# EAGLE design Uzebox Mini COLOR (EAGLE 5.06)
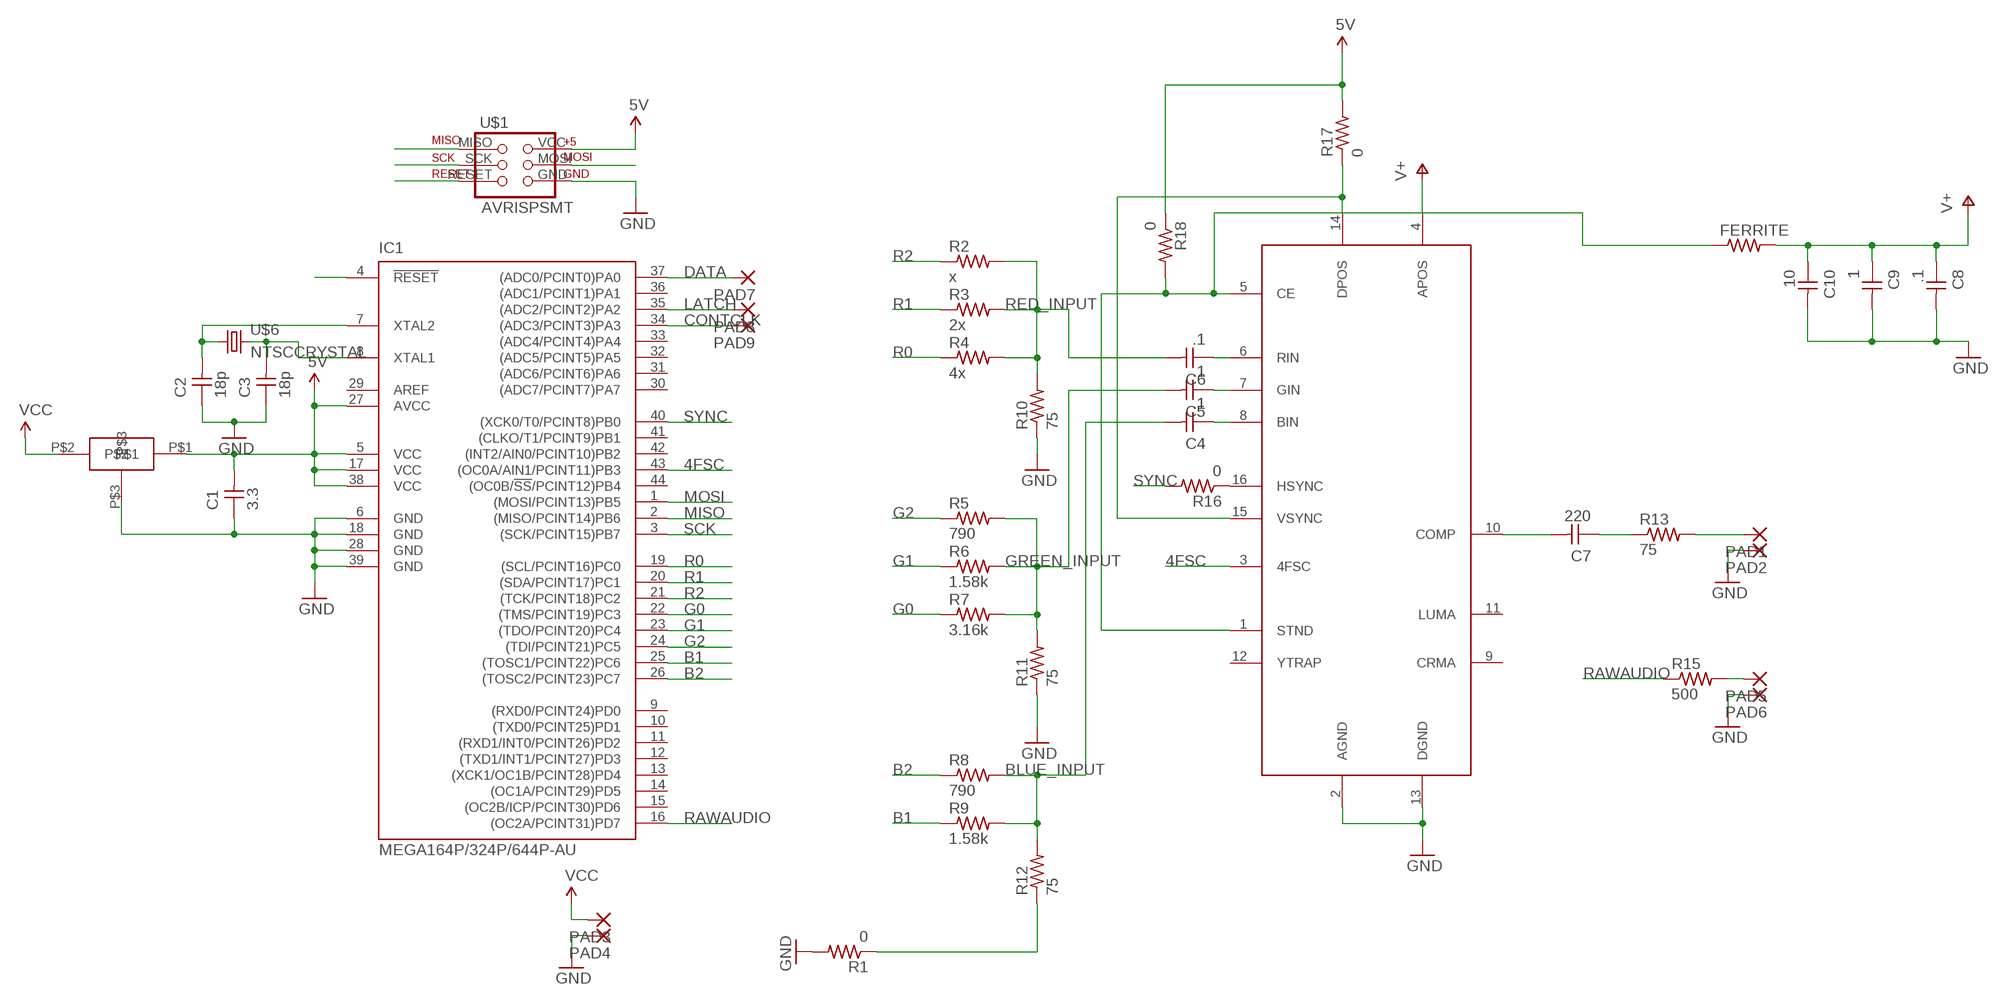
[diagram p0: schematic, sheet 1]

## Parts
C1  3.3  UNPOLARIZED_CAPACITOR1206  [1206]
C2  18p  UNPOLARIZED_CAPACITOR1206  [1206]
C3  18p  UNPOLARIZED_CAPACITOR1206  [1206]
C4  .1  UNPOLARIZED_CAPACITOR1206  [1206]
C5  .1  UNPOLARIZED_CAPACITOR1206  [1206]
C6  .1  UNPOLARIZED_CAPACITOR1206  [1206]
C7  220  UNPOLARIZED_CAPACITOR1206  [1206]
C8  .1  UNPOLARIZED_CAPACITOR1206  [1206]
C9  1  UNPOLARIZED_CAPACITOR1206  [1206]
C10  10  UNPOLARIZED_CAPACITOR1206  [1206]
FERRITE  RESISTOR1206  [1206]
IC1  MEGA164P/324P/644P-AU  MEGA164P/324P/644P-AUSMALLPADS  [TQFP44SMALLPADS]
PAD1  SMD2  [SMD1,27-2,54]
PAD2  SMD2  [SMD1,27-2,54]
PAD3  SMD2  [SMD1,27-2,54]
PAD4  SMD2  [SMD1,27-2,54]
PAD5  SMD2  [SMD1,27-2,54]
PAD6  SMD2  [SMD1,27-2,54]
PAD7  SMD2  [SMD1,27-2,54]
PAD8  SMD2  [SMD1,27-2,54]
PAD9  SMD2  [SMD1,27-2,54]
R1  0  RESISTOR1206  [1206]
R2  x  RESISTOR1206  [1206]
R3  2x  RESISTOR1206  [1206]
R4  4x  RESISTOR1206  [1206]
R5  790  RESISTOR1206  [1206]
R6  1.58k  RESISTOR1206  [1206]
R7  3.16k  RESISTOR1206  [1206]
R8  790  RESISTOR1206  [1206]
R9  1.58k  RESISTOR1206  [1206]
R10  75  RESISTOR1206  [1206]
R11  75  RESISTOR1206  [1206]
R12  75  RESISTOR1206  [1206]
R13  75  RESISTOR1206  [1206]
R15  500  RESISTOR1206  [1206]
R16  0  RESISTOR1206  [1206]
R17  0  RESISTOR1206  [1206]
R18  0  RESISTOR1206  [1206]
U$1  AVRISPSMT  [SMTAVRISP]
U$5  TINYREG  [SOT-23]
U$6  NTSCCRYSTAL  [NTSCCRYSTAL]
U$11  AD725  [SO16L]

## Nets
4FSC: IC1.43((OC0A/AIN1/PCINT11)PB3) U$11.3(4FSC)
5V: C1.2 IC1.5(VCC) IC1.17(VCC) IC1.27(AVCC) IC1.38(VCC) R17.2 R18.1 U$1.VCC U$5.P$1
AUDIO: PAD5.1(P) R15.2
B1: IC1.25((TOSC1/PCINT22)PC6) R9.1
B2: IC1.26((TOSC2/PCINT23)PC7) R8.1
BLUE_INPUT: C4.2 R8.2 R9.2 R12.2
CONTCLK: IC1.34((ADC3/PCINT3)PA3) PAD9.1(P)
DATA: IC1.37((ADC0/PCINT0)PA0) PAD7.1(P)
G0: IC1.22((TMS/PCINT19)PC3) R7.1
G1: IC1.23((TDO/PCINT20)PC4) R6.1
G2: IC1.24((TDI/PCINT21)PC5) R5.1
GND: C1.1 C2.1 C3.1 C8.2 C9.2 C10.2 IC1.6(GND) IC1.18(GND) IC1.28(GND) IC1.39(GND) PAD2.1(P) PAD4.1(P) PAD6.1(P) R1.2 R10.1 R11.1 U$1.GND U$5.P$3 U$11.2(AGND) U$11.13(DGND)
GREEN_INPUT: C5.2 R5.2 R6.2 R7.2 R11.2
LATCH: IC1.35((ADC2/PCINT2)PA2) PAD8.1(P)
MISO: IC1.2((MISO/PCINT14)PB6) U$1.MISO
MOSI: IC1.1((MOSI/PCINT13)PB5) U$1.MOSI
N$1: R17.1 U$11.14(DPOS) U$11.15(VSYNC)
N$2: C2.2 IC1.7(XTAL2) U$6.1
N$3: C3.2 IC1.8(XTAL1) U$6.3
N$5: C6.1 U$11.6(RIN)
N$6: C5.1 U$11.7(GIN)
N$7: C4.1 U$11.8(BIN)
N$8: C7.2 U$11.10(COMP)
N$9: C7.1 R13.1
N$10: PAD1.1(P) R13.2
N$11: R1.1 R12.1
N$12: R16.1 U$11.16(HSYNC)
N$16: FERRITE.1 R18.2 U$11.1(STND) U$11.5(CE)
R0: IC1.19((SCL/PCINT16)PC0) R4.1
R1: IC1.20((SDA/PCINT17)PC1) R3.1
R2: IC1.21((TCK/PCINT18)PC2) R2.1
RAWAUDIO: IC1.16((OC2A/PCINT31)PD7) R15.1
RED_INPUT: C6.2 R2.2 R3.2 R4.2 R10.2
RESET: IC1.4(!RESET) U$1.RESET
SCK: IC1.3((SCK/PCINT15)PB7) U$1.SCK
SYNC: IC1.40((XCK0/T0/PCINT8)PB0) R16.2
V+: C8.1 C9.1 C10.1 FERRITE.2 U$11.4(APOS)
VCC: PAD3.1(P) U$5.P$2
Unconnected: IC1.9((RXD0/PCINT24)PD0) IC1.10((TXD0/PCINT25)PD1) IC1.11((RXD1/INT0/PCINT26)PD2) IC1.12((TXD1/INT1/PCINT27)PD3) IC1.13((XCK1/OC1B/PCINT28)PD4) IC1.14((OC1A/PCINT29)PD5) IC1.15((OC2B/ICP/PCINT30)PD6) IC1.30((ADC7/PCINT7)PA7) IC1.31((ADC6/PCINT6)PA6) IC1.32((ADC5/PCINT5)PA5) IC1.33((ADC4/PCINT4)PA4) IC1.36((ADC1/PCINT1)PA1) IC1.41((CLKO/T1/PCINT9)PB1) IC1.42((INT2/AIN0/PCINT10)PB2) IC1.44((OC0B/!SS!/PCINT12)PB4) U$11.9(CRMA) U$11.11(LUMA) U$11.12(YTRAP)

## Power pins joined to a net without a drawn wire
AREF: IC1.29(AREF)

## Library data of the parts
C1-C10 = ng:UNPOLARIZED_CAPACITOR: unpolarized_capacitor
FERRITE R1-R13 R15-R18 = ng:RESISTOR
IC1 = avr-6:MEGA164P/324P/644P-AU
PAD1-PAD9 = wirepad:SMD2: SMD PAD
U$1 = david-lib:AVRISPSMT
U$5 = david-lib:TINYREG
U$6 = david-lib:NTSCCRYSTAL
U$11 = SparkFun:AD725

## Board
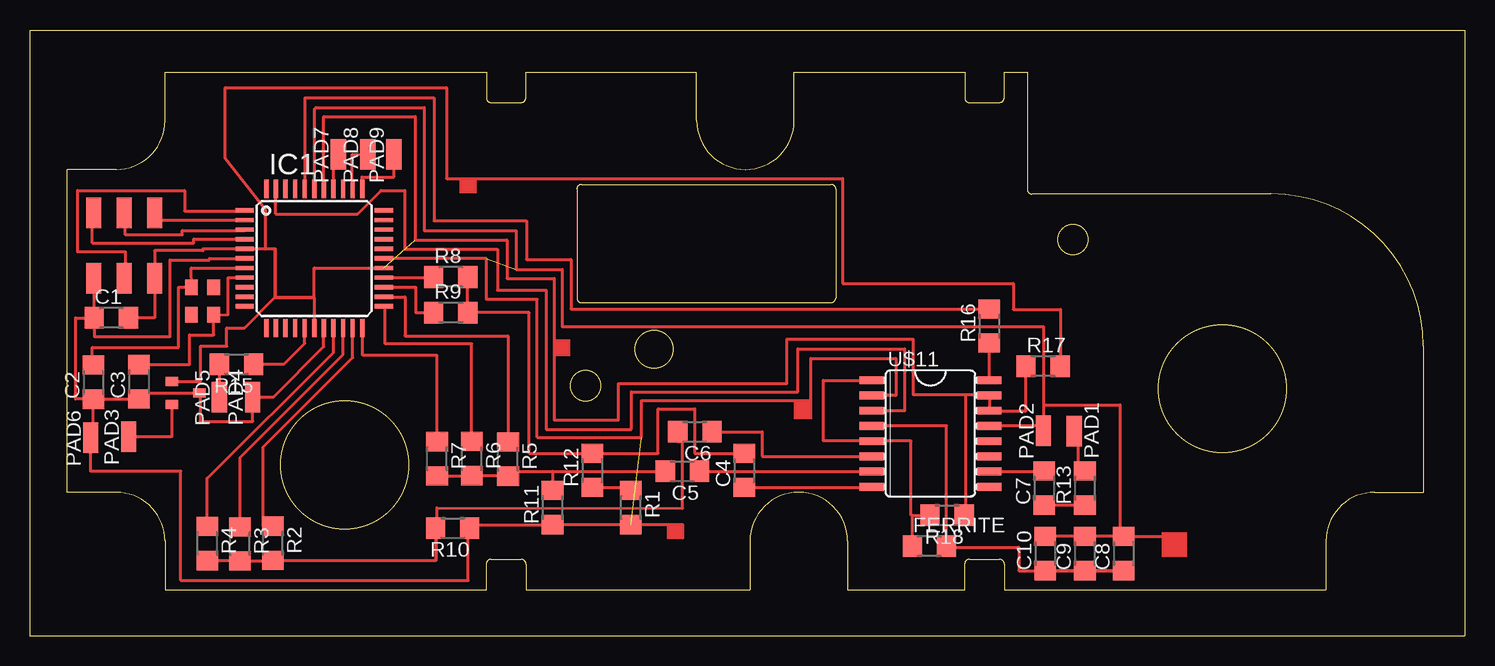
[diagram p1: board, top side]
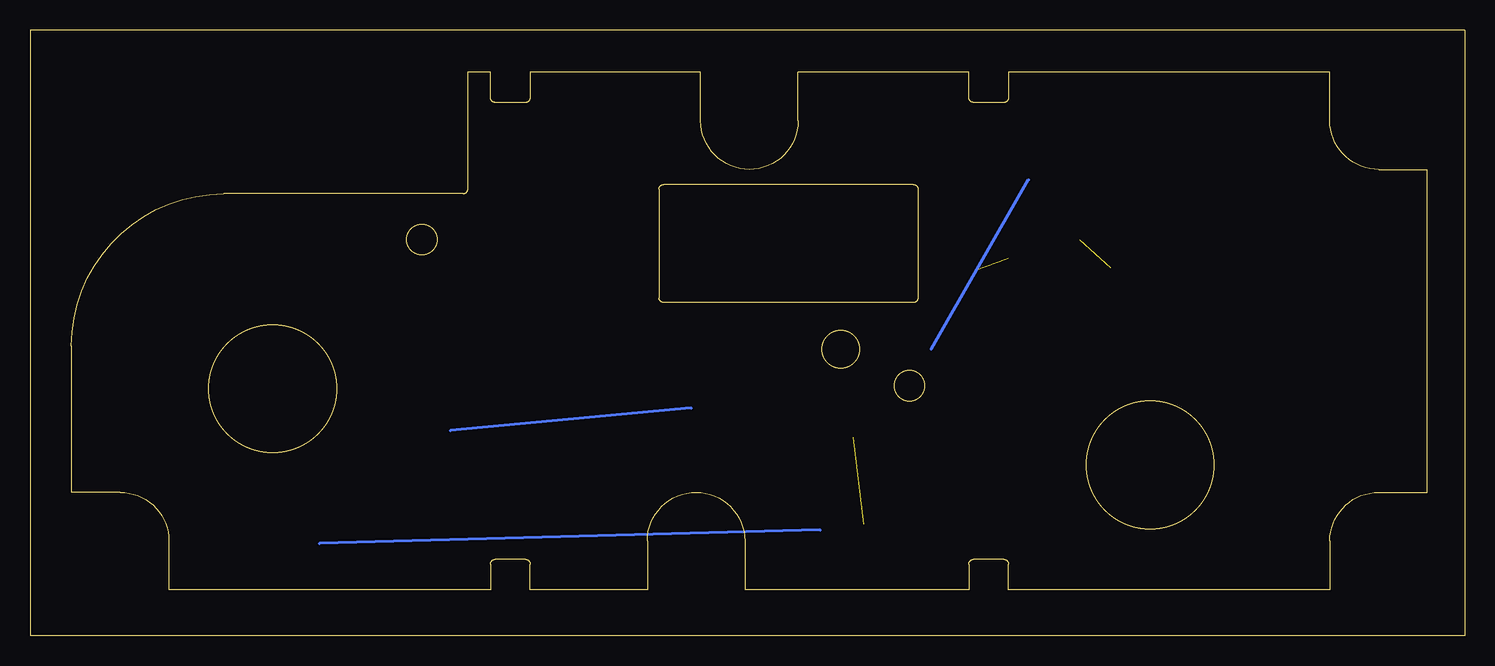
[diagram p2: board, bottom side, seen from below]

Size 119.61 x 50.52 mm. Coordinates in mm from the lower left corner, seen from the top.
Outline: 45.58,37.24 arc-92 45.97,37.64 66.78,37.64 arc-90 67.18,37.24 67.18,28.17
Outline: 45.97,27.78 arc-88 45.59,28.14 45.59,37.21
Outline: 67.17,28.17 arc-88 66.78,27.79 45.97,27.79
Outline: 38.43,44.46 arc-88 38.05,44.86 38.05,47.02 11.25,47.02 11.25,42.95 arc-90 7.19,38.89 3.12,38.89 3.12,11.96 7.19,11.96 arc-90 11.25,7.9 11.25,3.84 38.05,3.84 38.05,5.97
Outline: 41.34,44.86 arc-88 40.94,44.48 38.43,44.48
Outline: 78.31,44.46 arc-88 77.93,44.86 77.93,47.02 63.7,47.02 63.7,42.95 arc-180 55.58,42.95 55.58,47.02 41.35,47.02 41.35,44.86
Outline: 81.22,44.86 arc-88 80.82,44.48 78.31,44.48
Outline: 38.04,5.97 arc-92 38.43,6.38 40.94,6.38 arc-90 41.35,5.97 41.35,3.84 60.02,3.84 60.02,7.9 arc-180 68.15,7.9 68.15,3.84 77.93,3.84 77.93,5.97
Outline: 77.91,5.97 arc-92 78.31,6.38 80.82,6.38 arc-90 81.23,5.97 81.23,3.84 108.03,3.84 108.03,7.9 arc-90 112.09,11.96 116.15,11.96 116.15,24.16 arc90 103.45,36.86 83.52,36.86
Outline: 83.51,36.84 arc-88 83.13,37.24 83.13,47.02 81.23,47.02 81.23,44.86
Outline: 0,50.52 119.61,50.52 119.61,0 0,0 0,50.52
Outline: circle at 99.39,20.6 radius 5.33
Outline: circle at 26.24,14.25 radius 5.33
Outline: circle at 86.94,33.05 radius 1.27
Outline: circle at 52.02,23.9 radius 1.57
Outline: circle at 46.3,20.85 radius 1.27
Copper layers (1*16): Top 0.035mm / dielectric 1.5mm / Bottom 0.035mm
Design rules "default *": minimum track width 10mil, minimum drill 24mil, track to track 0.3962mm, track to pad 0.3962mm, pad to pad 0.3962mm, via to via 0.3962mm, smd to smd 8mil, copper to edge 40mil, drill to drill 8mil, minimum pad ring 10mil, minimum via ring 8mil, stop-mask expansion 4mil, vias tented up to drill 0mil, thermal gap 10mil

### Footprints (pad centres in the part's own frame; a part is rotated, then mirrored left to right if it is on the bottom)
1206 = smd 1.6 x 1.803: 1 -1.422,0; 2 1.422,0
TQFP44SMALLPADS = smd 1.524 x 0.356: 1 -5.8,4; 2 -5.8,3.2; 3 -5.8,2.4; 4 -5.8,1.6; 5 -5.8,0.8; 6 -5.8,0; 7 -5.8,-0.8; 8 -5.8,-1.6; 9 -5.8,-2.4; 10 -5.8,-3.2; 11 -5.8,-4; 23 5.8,-4; 24 5.8,-3.2; 25 5.8,-2.4; 26 5.8,-1.6; 27 5.8,-0.8; 28 5.8,0; 29 5.8,0.8; 30 5.8,1.6; 31 5.8,2.4; 32 5.8,3.2; 33 5.8,4 | smd 0.356 x 1.524: 12 -4,-5.8; 13 -3.2,-5.8; 14 -2.4,-5.8; 15 -1.6,-5.8; 16 -0.8,-5.8; 17 0,-5.8; 18 0.8,-5.8; 19 1.6,-5.8; 20 2.4,-5.8; 21 3.2,-5.8; 22 4,-5.8; 34 4,5.8; 35 3.2,5.8; 36 2.4,5.8; 37 1.6,5.8; 38 0.8,5.8; 39 0,5.8; 40 -0.8,5.8; 41 -1.6,5.8; 42 -2.4,5.8; 43 -3.2,5.8; 44 -4,5.8
SMD1,27-2,54 = smd 1.27 x 2.54: 1 0,0
SMTAVRISP = smd 1.27 x 2.54: GND 0,-5.46; MISO 5.08,0; MOSI 2.54,-5.46; RESET 0,0; SCK 2.54,0; VCC 5.08,-5.46
SOT-23 = smd 0.762 x 1.016: P$1 0,0; P$2 1.905,0; P$3 0.953,2.286
NTSCCRYSTAL = smd 1.3 x 1.05: 1 0,-1.85; 2 2.3,-1.85; 3 2.3,0; 4 0,0
SO16L = smd 0.66 x 2.032: 1 -4.445,-4.902; 2 -3.175,-4.902; 3 -1.905,-4.902; 4 -0.635,-4.902; 5 0.635,-4.902; 6 1.905,-4.902; 7 3.175,-4.902; 8 4.445,-4.902; 9 4.445,4.902; 10 3.175,4.902; 11 1.905,4.902; 12 0.635,4.902; 13 -0.635,4.902; 14 -1.905,4.902; 15 -3.175,4.902; 16 -4.445,4.902

### Placement (x,y rotation side)
C1  6.78,26.52 0 top
C2  5.28,21.16 90 top
C3  9.09,21.18 90 top
C4  59.54,13.79 90 top
C5  54.38,13.72 180 top
C6  55.42,17.02 180 top
C7  84.56,12.32 90 top
C8  91.16,6.86 90 top
C9  87.93,6.86 90 top
C10  84.63,6.86 90 top
FERRITE  74.98,7.47 0 top
IC1  23.7,31.47 0 top
PAD1  87.05,17.07 180 top
PAD2  84.48,17.12 0 top
PAD3  8.23,16.61 0 top
PAD4  18.57,19.91 0 top
PAD5  15.8,19.89 0 top
PAD6  5.05,16.51 0 top
PAD7  25.7,40.13 0 top
PAD8  28.17,40.13 0 top
PAD9  30.33,40.13 0 top
R1  50.09,10.69 270 top
R2  20.24,7.72 270 top
R3  17.5,7.67 270 top
R4  14.78,7.7 270 top
R5  39.85,14.73 270 top
R6  36.83,14.78 270 top
R7  33.93,14.76 270 top
R8  35.08,29.92 0 top
R9  35.08,26.95 0 top
R10  35.23,8.99 180 top
R11  43.56,10.69 90 top
R12  46.86,13.79 90 top
R13  87.93,12.32 90 top
R15  17.22,22.66 180 top
R16  79.96,25.83 90 top
R17  84.45,22.48 0 top
R18  76.45,10.06 180 top
U$1  5.31,35.26 0 top
U$5  11.84,21.21 270 top
U$6  15.32,29.06 270 top
U$11  75.06,16.87 270 top

### Tracks (layer width: path | path; a pad name or v marks a point on that pad's centre or on a via)
4FSC
  Top 0.254: U$11.3 72.9,18.77 72.9,23.93 64.01,23.93 64.01,20.35 50.14,20.35 50.14,17.22 43.03,17.22 43.03,28.83 38.96,28.83 38.96,32.23 31.24,32.23 31.24,37.14 29.26,37.14 27.3,35.18 20.5,35.18 IC1.43
5V  (1 unrouted)
  Top 0.254: C1.2 10.39,26.52 U$1.VCC 10.39,32.11 14.4,32.11 14.4,32.27 IC1.5 17.9,32.26 20.45,32.26 20.45,32.23 | 11.89,21.18 11.89,21.21 U$5.P$1 14.22,21.21 14.22,24.16 16.41,24.16 16.41,25.68 17.88,25.68 20.4,28.19 23.7,28.19 | 23.7,28.19 23.7,28.17 | 23.7,28.17 IC1.17 | 23.7,28.19 20.45,28.19 20.45,32.23 | IC1.38 24.49,43.31 32.11,43.31 32.11,33.02 39.75,33.02 39.75,29.79 43.69,29.79 43.69,17.98 49.05,17.98 49.05,21.03 63.09,21.03 63.09,24.74 73.61,24.74 73.61,20.12 77.98,20.12 | 77.98,20.12 79.96,20.12 | 23.7,28.19 23.7,30.67 IC1.27 29.21,30.67 29.21,30.66 29.29,30.66 | 23.7,28.17 23.7,30.53 | 23.7,28.17 20.45,28.17 20.45,32.23 | 20.45,32.23 19.63,32.23 19.63,35.48 16.28,39.8 16.28,45.72 34.72,45.72 34.72,38.13 67.74,38.13 67.74,29.39 81.97,29.39 81.97,27.23 85.9,27.23 85.9,22.48 R17.2 | R18.1 77.98,10.06 77.98,20.12
AUDIO
  Top 0.254: R15.2 PAD5.1
B1
  Top 0.254: R9.1 32.16,26.95 32.16,29.08 IC1.25
B2
  Top 0.254: IC1.26 33.66,29.87 R8.1
BLUE_INPUT
  Top 0.254: C4.2 55.4,15.21 55.4,18.92 52.37,18.92 52.37,15.21 R12.2 41.61,15.21 41.61,26.95 R9.2 R8.2
CONTCLK
  Top 0.254: IC1.34 27.69,38.25 30.35,38.25 PAD9.1
DATA
  Top 0.254: IC1.37 | IC1.37 25.3,39.12 25.86,39.12 PAD7.1
G0
  Top 0.254: IC1.22 27.74,25.67 27.74,23.39 33.93,23.39 R7.1
G1
  Top 0.254: IC1.23 29.62,27.47 29.62,24.33 36.83,24.33 R6.1
G2
  Top 0.254: IC1.24 31.27,28.27 31.27,25.02 39.85,25.02 R5.1
GND  (2 unrouted)
  Top 0.254: C10.2 C9.2 C8.2 | C10.2 84.2,8.28 | C10.2 84.56,8.28 | U$1.GND 5.36,29.8 C1.1 | C1.1 5.36,24.94 11.68,24.94 11.68,31.34 14.96,31.34 14.96,31.47 IC1.6 | C2.1 9.09,19.74 C3.1 9.09,20.26 U$5.P$3 14.17,20.26 14.17,17.88 18.57,17.88 PAD4.1 20.29,19.91 24.49,24.1 24.49,25.66 IC1.18 | C2.1 5.28,16.51 PAD6.1 5.05,13.72 12.57,13.72 12.57,4.62 36.53,4.62 36.53,9.25 36.68,9.25 | C2.1 3.81,19.74 3.81,26.52 C1.1 | C1.1 5.94,26.52 | R11.1 43.56,9.25 | R10.1 36.68,8.43 36.68,9.25 | 36.68,9.25 43.56,9.25 | 43.56,9.25 R11.1 | U$11.2 72.19,20.04 72.19,23.14 65.1,23.14 65.1,19.61 50.98,19.61 50.98,16.56 42.29,16.56 42.29,28.04 38.05,28.04 38.05,31.45 29.5,31.45 IC1.28 | IC1.39 23.72,37.27 23.72,43.92 23.85,44.04 32.87,44.04 32.87,33.78 40.54,33.78 40.54,30.56 44.37,30.56 44.37,25.78 84.48,25.78 84.48,19.25 | 84.48,19.25 PAD2.1 84.48,17.5 U$11.13 | C8.2 90.86,8.28 90.86,19.25 84.48,19.25 | R11.1 R1.2 54.41,9.27 54.41,8.15 | 94.84,8.31 91.16,8.31 C8.2
GREEN_INPUT
  Top 0.254: R7.2 36.83,13.34 R6.2 39.85,13.36 R5.2 39.98,13.31 39.98,13.72 43.56,13.72 | 43.56,13.72 C5.2 | 43.56,13.72 R11.2
LATCH
  Top 0.254: IC1.35 26.87,37.27 26.87,40.16 PAD8.1
MISO
  Top 0.254: IC1.2 10.39,34.67 U$1.MISO
MOSI
  Top 0.254: U$1.MOSI 7.95,29.8 7.95,32.03 3.96,32.03 3.96,37.14 12.88,37.14 12.88,35.43 17.9,35.43 IC1.1
N$1
  Top 0.254: R17.1 83.03,18.77 U$11.14 U$11.15
N$2
  Top 0.254: IC1.7 13.44,30.67 U$6.1 13.47,29.08 12.4,29.08 12.4,24.05 5.21,24.05 5.21,22.58 C2.2
N$3
  Top 0.254: IC1.8 16.51,29.87 16.51,26.78 U$6.3 15.32,25.1 13.31,25.1 13.31,22.61 C3.2 | IC1.8
N$5
  Top 0.254: C6.1 61.04,17.02 61.04,14.96 U$11.6
N$6
  Top 0.254: C5.1 70.15,13.72 U$11.7
N$7
  Top 0.254: 59.54,12.42 C4.1 70.15,12.37 U$11.8
N$8
  Top 0.254: U$11.10 84.56,13.69 C7.2
N$9
  Top 0.254: C7.1 R13.1
N$10
  Top 0.254: PAD1.1 87.4,17.07 87.4,13.84 87.93,13.84 R13.2
N$11
  Top 0.254: R12.1 50.09,12.37 R1.1
N$12
  Top 0.254: U$11.16 R16.1
N$13
  Bottom 0.254: 64.49,19 84.56,17.12
N$14
  Bottom 0.254: 44.48,23.9 36.37,38.02
N$15
  Bottom 0.254: 53.75,8.81 95.48,7.7
N$16
  Top 0.254: 73.25,7.47 FERRITE.1 73.56,10.06 73.46,10.06 | U$11.1 66.14,21.31 66.14,16.26 70.15,16.26 U$11.5 73.46,16.23 73.46,10.06 | 73.46,10.06 R18.2
R0
  Top 0.254: IC1.19 25.3,23.62 14.76,13.13 14.76,9.12 R4.1
R1
  Top 0.254: IC1.20 26.1,23.46 17.5,14.86 R3.1
R2
  Top 0.254: IC1.21 26.9,23.19 19.43,15.75 19.43,9.14 R2.1
RAWAUDIO
  Top 0.254: R15.1 21.18,22.66 22.91,24.38 22.91,25.66 IC1.16
RED_INPUT
  Top 0.254: C6.2 54,16.18 54.41,16.18 54.41,10.64 54.36,10.64 33.93,10.67 33.93,8.43 R10.2 33.86,8.43 33.86,8.15 | R4.2 17.5,6.27 R3.2 20.24,6.25 R2.2 | 33.86,8.15 33.86,6.43 | R2.2 20.24,6.43 | R2.2 33.86,6.3 33.86,8.15
RESET
  Top 0.254: U$1.RESET 5.21,35.26 5.21,32.77 13.67,32.77 13.67,33.1 17.9,33.1 IC1.4
SCK
  Top 0.254: U$1.SCK 7.95,35.26 7.95,33.45 12.7,33.45 12.7,33.81 17.9,33.81 IC1.3
SYNC
  Top 0.254: IC1.40 22.94,37.27 22.94,44.86 33.68,44.86 33.68,34.62 41.38,34.62 41.38,31.39 45.08,31.39 45.08,27.25 R16.2 | R16.2
V+
  Top 0.254: 84.56,5.41 84.56,4.75 84.63,4.75 C10.1 C9.1 C8.1 82.42,5.44 82.42,7.39 76.4,7.39 FERRITE.2 76.4,17.5 U$11.4
VCC
  Top 0.254: PAD3.1 11.84,16.61 U$5.P$2
(copper drawn outside any net)
  shapes: Top area x5